# EAGLE design ECE445-Receiver-Schematic (EAGLE 7.5.0)
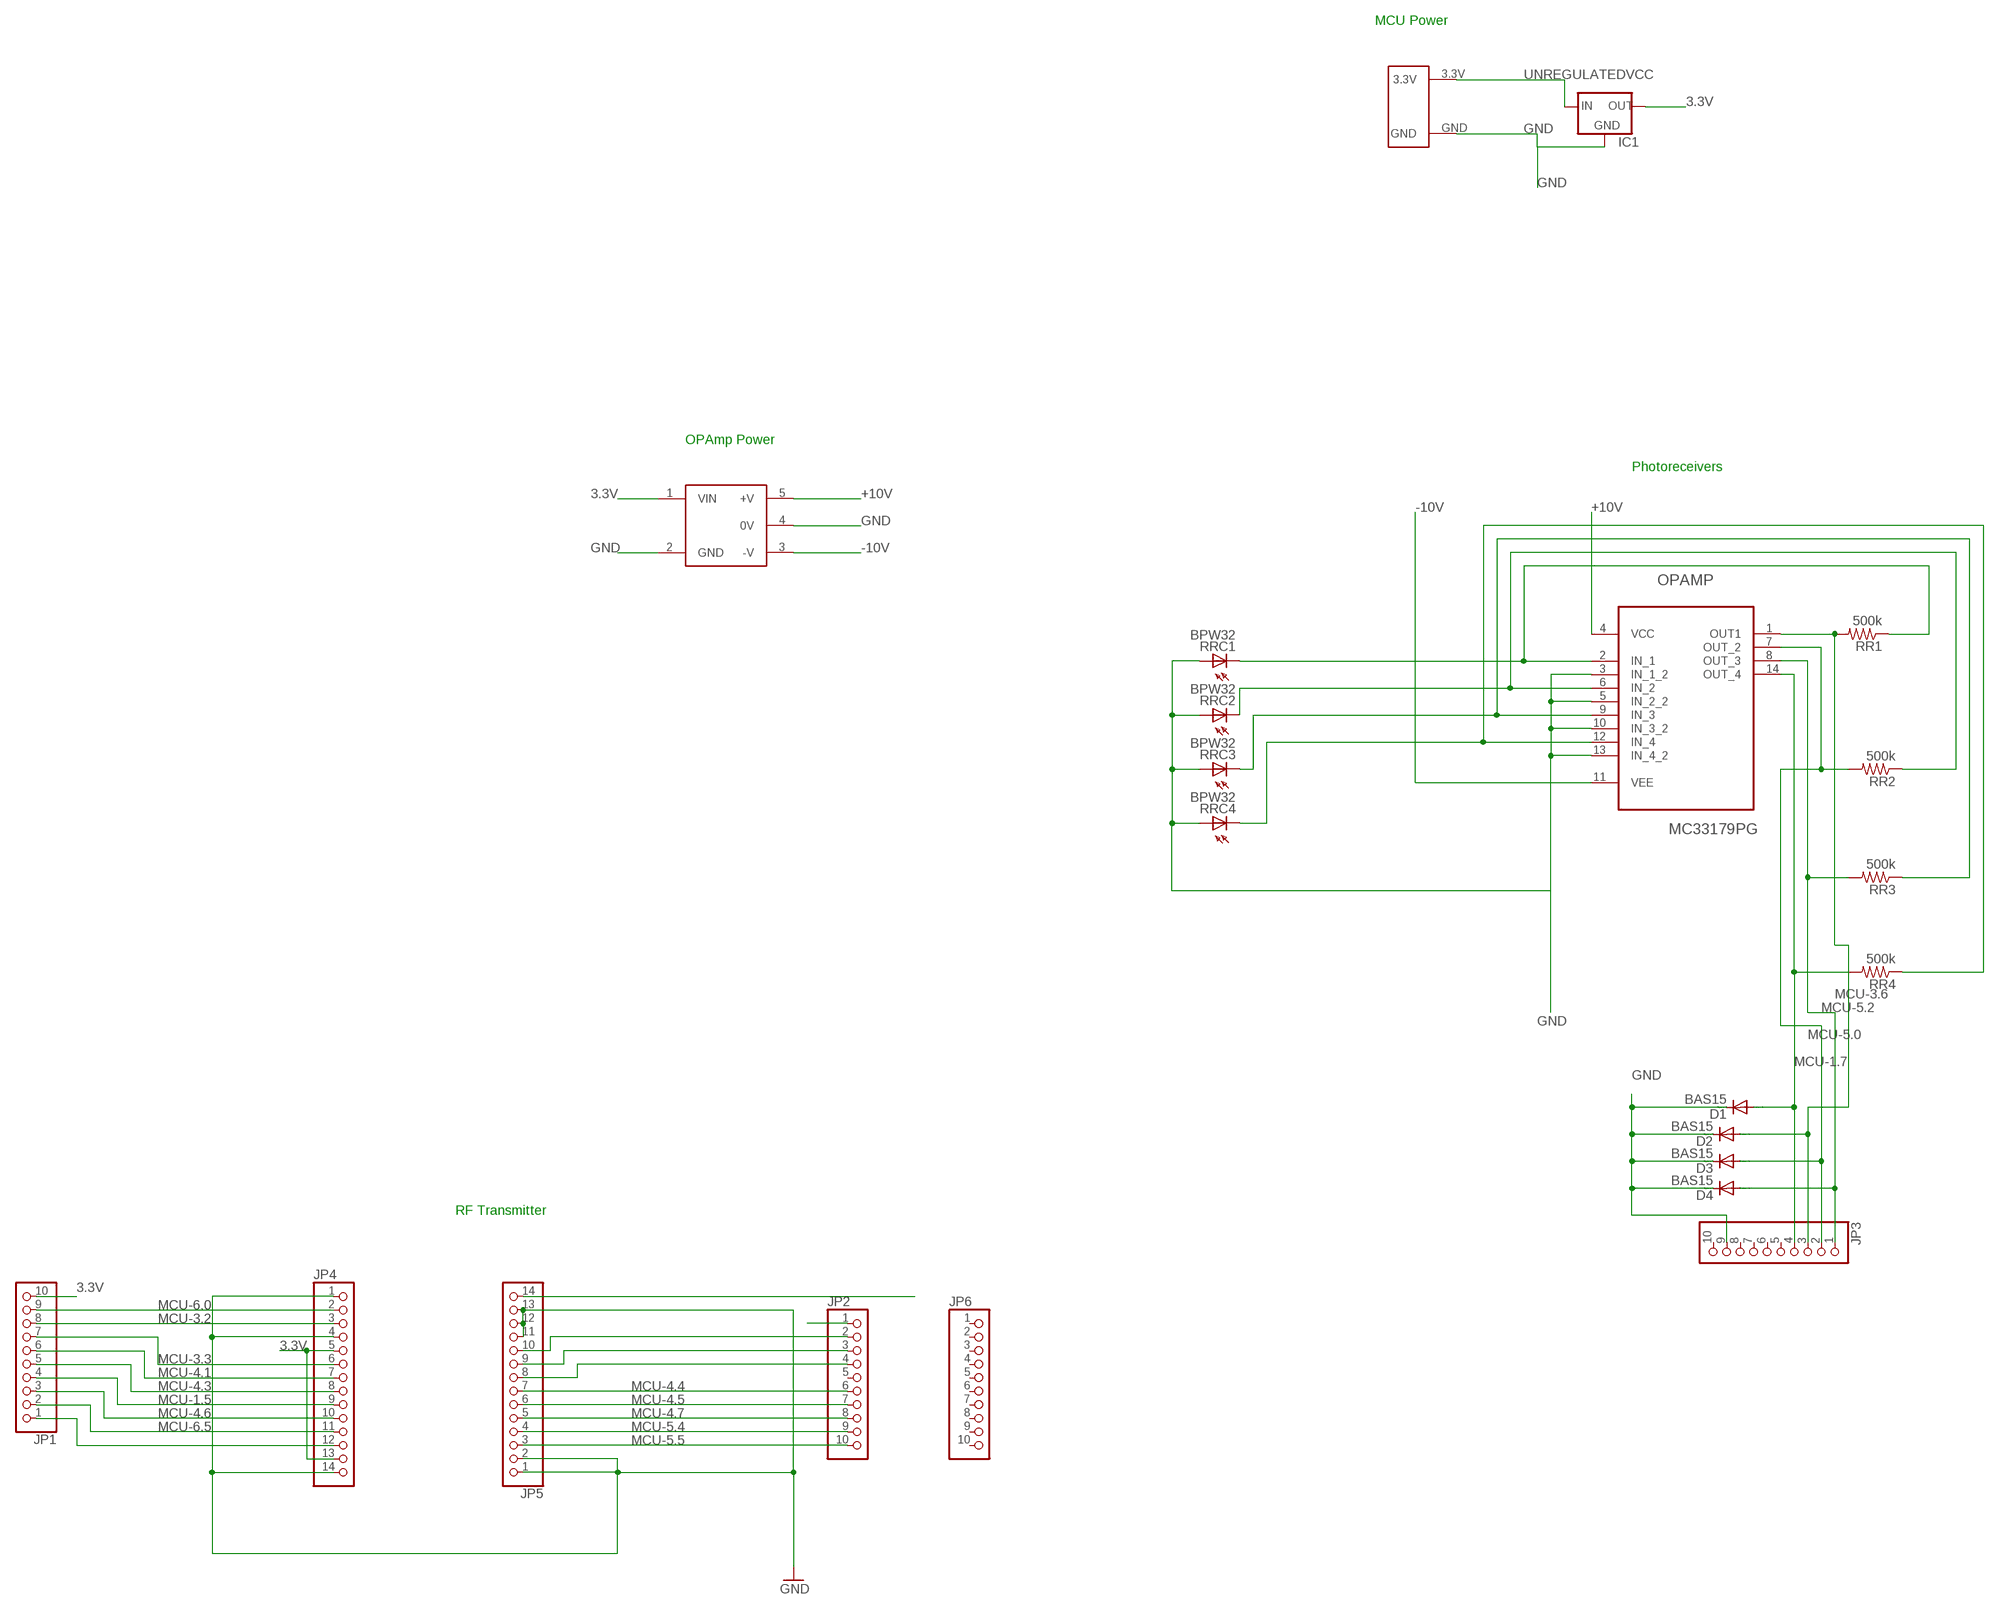
[diagram p0: schematic, sheet 1]

## Parts
D1  BAS15  [DO34-7]
D2  BAS15  [DO34-7]
D3  BAS15  [DO34-7]
D4  BAS15  [DO34-7]
IC1  78LXX  [78LXX]
JP1  PINHD-1X10  [1X10]
JP2  PINHD-1X10  [1X10]
JP3  PINHD-1X10  [1X10]
JP4  PINHD-1X14  [1X14]
JP5  PINHD-1X14  [1X14]
JP6  PINHD-1X10  [1X10]
OPAMP  MC33179PG  [DIP254P762X469-14]
RR1  500k  R-US_0204/5  [0204/5]
RR2  500k  R-US_0204/5  [0204/5]
RR3  500k  R-US_0204/5  [0204/5]
RR4  500k  R-US_0204/5  [0204/5]
RRC1  BPW32  [BPW32]
RRC2  BPW32  [BPW32]
RRC3  BPW32  [BPW32]
RRC4  BPW32  [BPW32]
U$13  PDM1-S3-D12-S  [PDM1-S3-D12-S]
U$14  BATTERY  [BATTERY]

## Nets
3.3V: IC1.OUT JP1.10 JP4.5 JP4.13 U$13.1(VIN)
+10V: OPAMP.4(VCC) U$13.5(+V)
-10V: OPAMP.11(VEE) U$13.3(-V)
ANT: JP5.14
GND: D1.C D2.C D3.C D4.C IC1.GND JP2.1 JP3.9 JP4.1 JP4.4 JP4.14 JP5.1 JP5.2 JP5.11 JP5.12 JP5.13 OPAMP.3(IN_1_2) OPAMP.5(IN_2_2) OPAMP.10(IN_3_2) OPAMP.13(IN_4_2) RRC1.A RRC2.A RRC3.A RRC4.A U$13.2(GND) U$13.4(0V) U$14.GND
MCU-1.5: JP1.4 JP4.9
MCU-1.7: D4.A JP3.1 OPAMP.8(OUT_3) RR3.2
MCU-3.2: JP1.8 JP4.3
MCU-3.3: JP1.7 JP4.6
MCU-3.6: D1.A JP3.4 OPAMP.14(OUT_4) RR4.2
MCU-4.1: JP1.6 JP4.7
MCU-4.3: JP1.5 JP4.8
MCU-4.4: JP2.6 JP5.7
MCU-4.5: JP2.7 JP5.6
MCU-4.6: JP1.3 JP4.10
MCU-4.7: JP2.8 JP5.5
MCU-5.0: D3.A JP3.2 OPAMP.7(OUT_2) RR2.2
MCU-5.2: D2.A JP3.3 OPAMP.1(OUT1) RR1.2
MCU-5.4: JP2.9 JP5.4
MCU-5.5: JP2.10 JP5.3
MCU-6.0: JP1.9 JP4.2
MCU-6.4: JP1.1 JP4.12
MCU-6.5: JP1.2 JP4.11
N$1: JP2.2 JP5.10
N$4: JP2.3 JP5.9
N$5: JP2.4 JP5.8
N$10: OPAMP.6(IN_2) RR2.1 RRC2.K(C)
N$14: OPAMP.9(IN_3) RR3.1 RRC3.K(C)
RRC1: OPAMP.2(IN_1) RR1.1 RRC1.K(C)
RRC4: OPAMP.12(IN_4) RR4.1 RRC4.K(C)
UNREGULATEDVCC: IC1.IN U$14.3.3V
Unconnected: JP2.5 JP3.5 JP3.6 JP3.7 JP3.8 JP3.10 JP6.1 JP6.2 JP6.3 JP6.4 JP6.5 JP6.6 JP6.7 JP6.8 JP6.9 JP6.10

## Notes on the sheet
- MCU Power
- OPAmp Power
- Photoreceivers
- RF Transmitter

## Library data of the parts
D1-D4 = diode:BAS15: DIODE high speed
IC1 = MarkSmartsPartsSpring2015:78LXX: VOLTAGE REGULATOR
JP1-JP3 JP6 = pinhead:PINHD-1X10: PIN HEADER
JP4 JP5 = pinhead:PINHD-1X14: PIN HEADER
OPAMP = ON Semiconductor_By_element14_Batch_1:MC33179PG: Operational Amplifiers; MPN: MC33179PG; OC_FARNELL: 9666826; OC_NEWARK: 26K4013; PACKAGE: PDIP-14; SUPPLIER: On Semiconductor
RR1-RR4 = rcl:R-US_: RESISTOR, American symbol
RRC1-RRC4 = opto-trans-siemens:BPW32: PHOTO DIODE; OC_FARNELL: unknown; OC_NEWARK: unknown
U$13 = PDM1-S3-D12-S:PDM1-S3-D12-S
U$14 = battery:BATTERY

## Module PHOTORECEIVER
Ports: IN(io) OUT(io)

### Library data of the parts

## Board
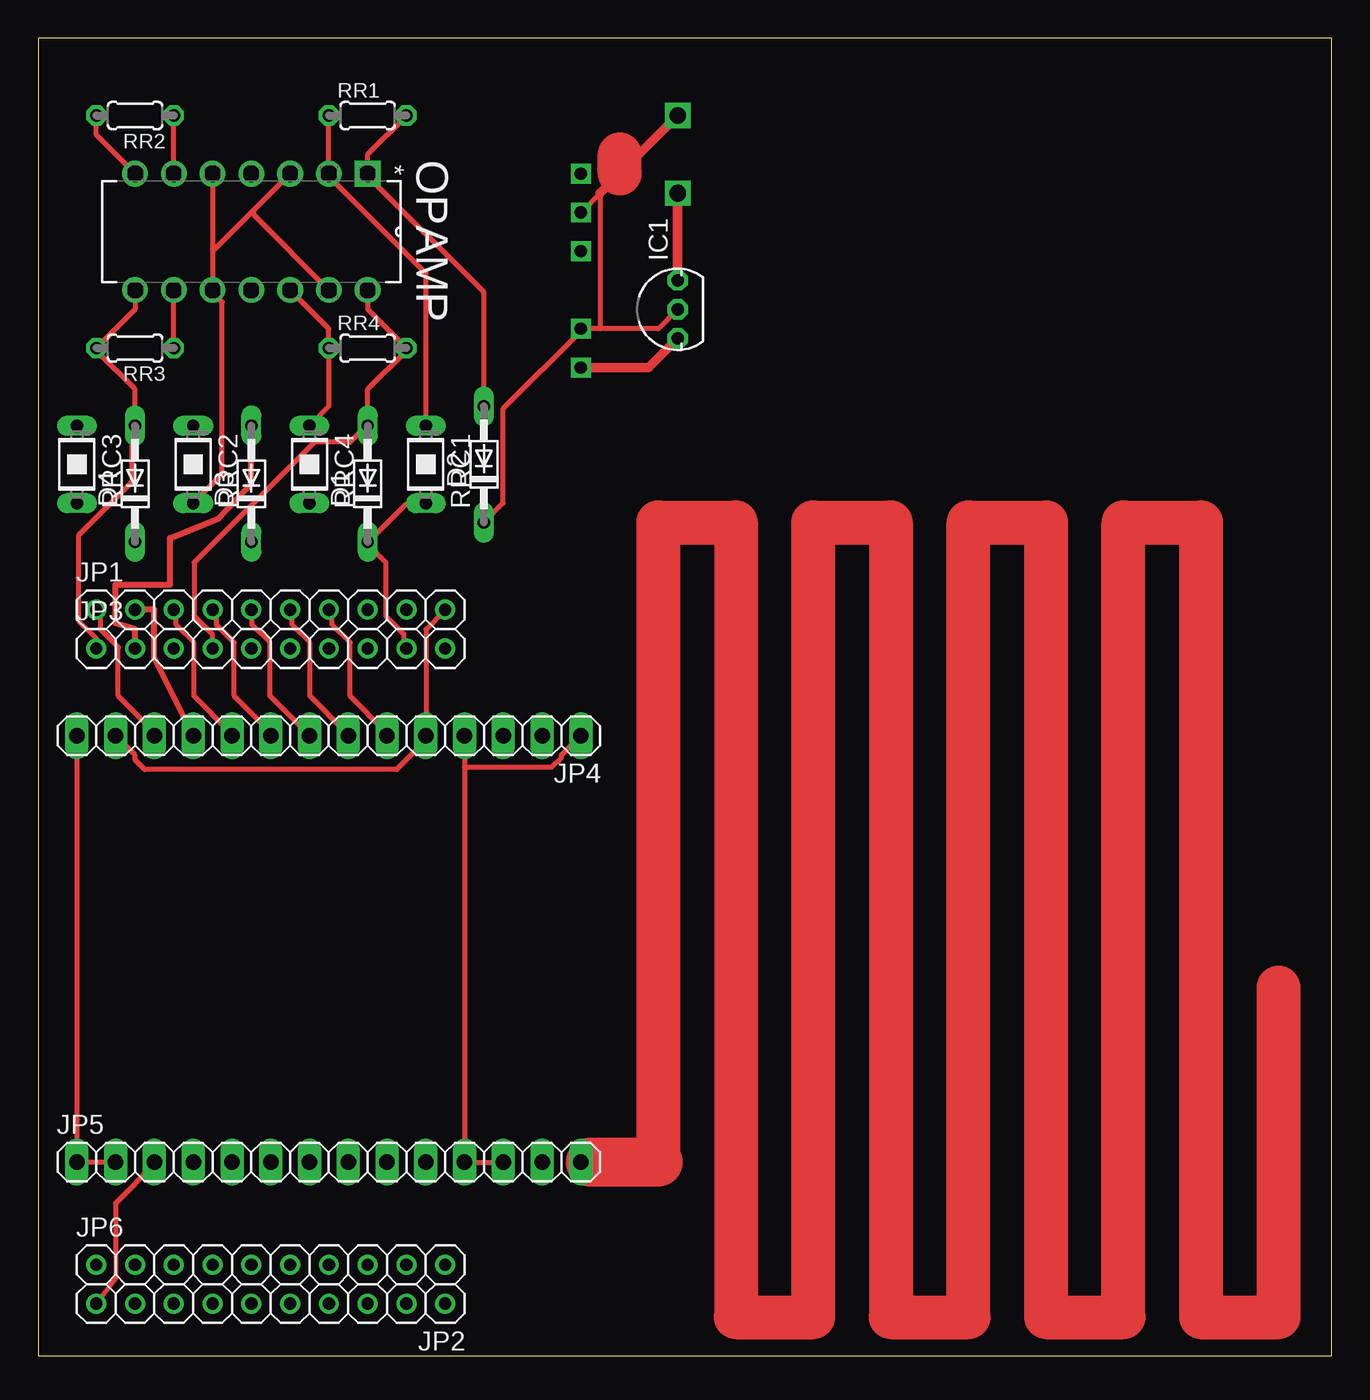
[diagram p1: board, top side]
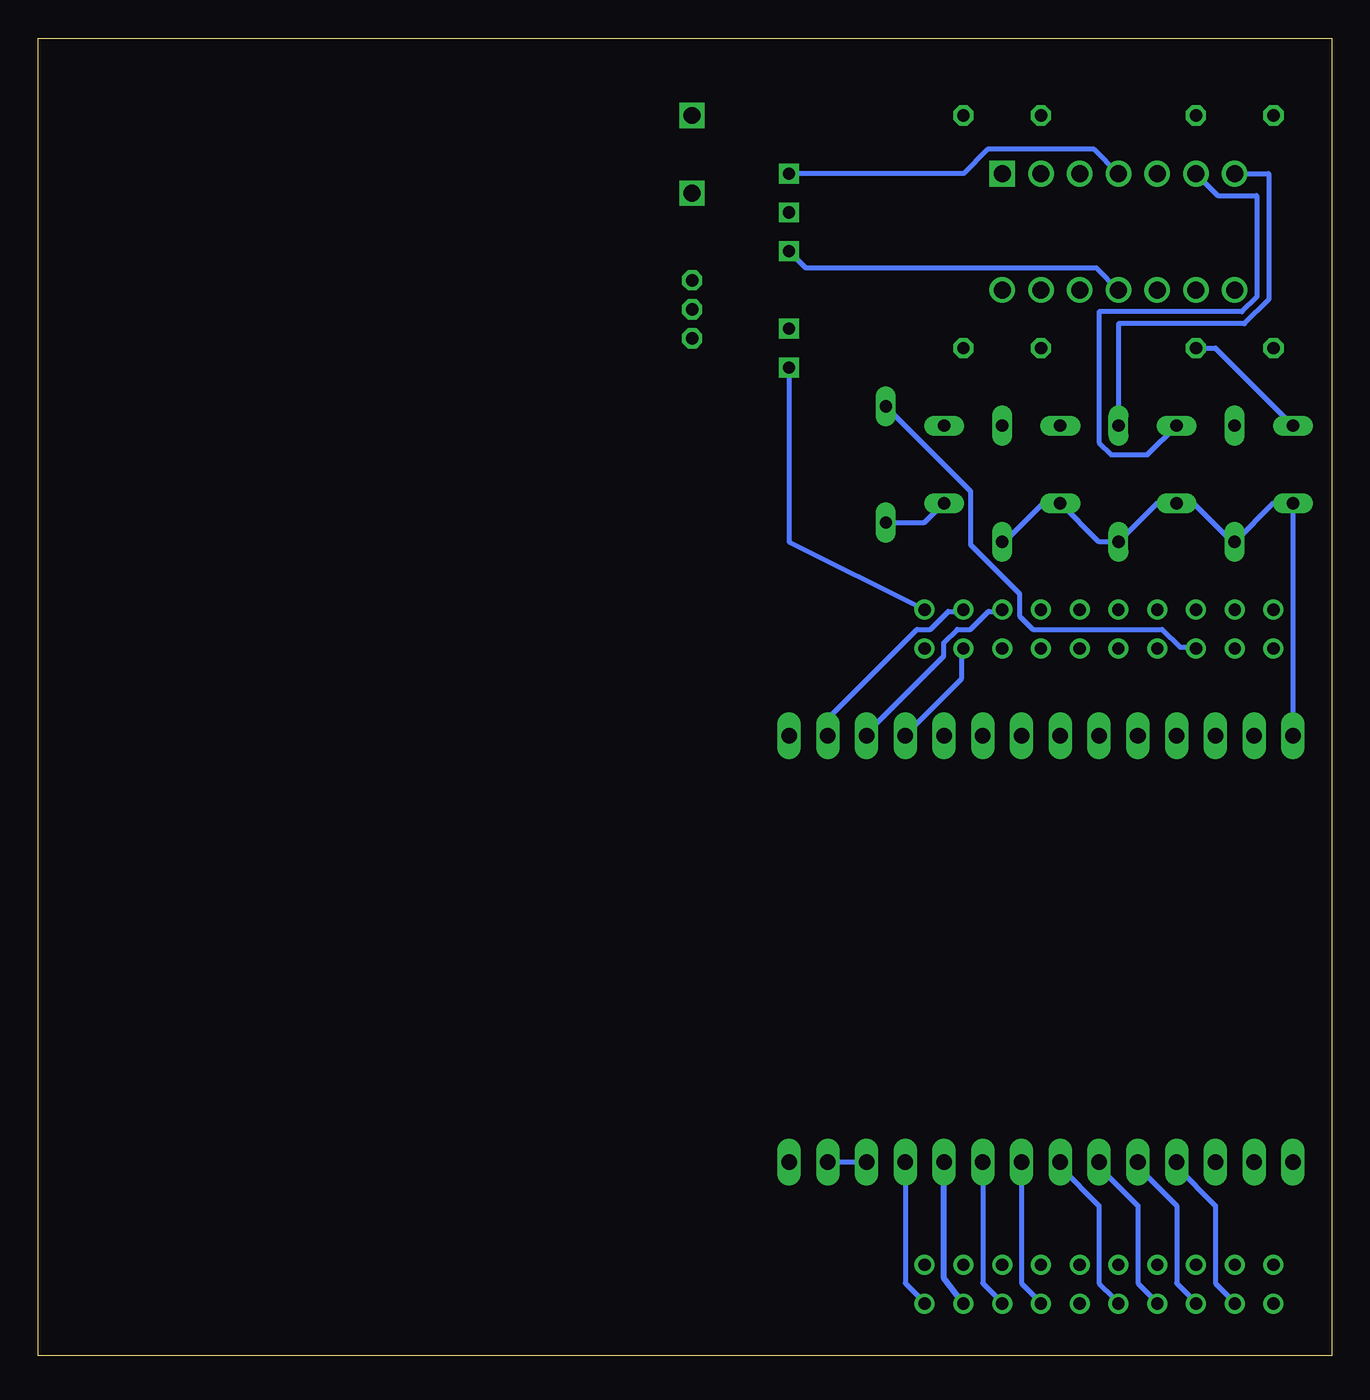
[diagram p2: board, bottom side, seen from below]

Size 84.76 x 86.35 mm. Coordinates in mm from the lower left corner, seen from the top.
Outline: 0,0 84.76,0 84.76,86.35 0,86.35 0,0
Copper layers (1*16): Top 0.035mm / dielectric 1.5mm / Bottom 0.035mm
Design rules "MWSEagleDesignRules2 *": minimum track width 13mil, minimum drill 22mil, track to track 10mil, track to pad 10mil, pad to pad 10mil, via to via 10mil, smd to smd 8mil, copper to edge 40mil, drill to drill 8mil, minimum pad ring 10mil, minimum via ring 8mil, stop-mask expansion 4mil, vias tented up to drill 0mil, thermal gap 10mil
vRestrict: area 3.8,69.8 to 24.1,77.5

### Footprints (pad centres in the part's own frame; a part is rotated, then mirrored left to right if it is on the bottom)
DO34-7 = drill 0.813 long: A 3.81,0; C -3.81,0
78LXX = drill 0.813 octagon: GND 0,0; IN 1.905,0; OUT -1.905,0
1X10 = drill 0.8: 1 -11.43,0; 2 -8.89,0; 3 -6.35,0; 4 -3.81,0; 5 -1.27,0; 6 1.27,0; 7 3.81,0; 8 6.35,0; 9 8.89,0; 10 11.43,0; 11 -8.89,0
1X14 = drill 1.016 long: 1 -16.51,0; 2 -13.97,0; 3 -11.43,0; 4 -8.89,0; 5 -6.35,0; 6 -3.81,0; 7 -1.27,0; 8 1.27,0; 9 3.81,0; 10 6.35,0; 11 8.89,0; 12 11.43,0; 13 13.97,0; 14 16.51,0
DIP254P762X469-14 = drill 1.118 square: 1 -7.62,15.24 | drill 1.118: 2 -7.62,12.7; 3 -7.62,10.16; 4 -7.62,7.62; 5 -7.62,5.08; 6 -7.62,2.54; 7 -7.62,0; 8 0,0; 9 0,2.54; 10 0,5.08; 11 0,7.62; 12 0,10.16; 13 0,12.7; 14 0,15.24
0204/5 = drill 0.813 octagon: 1 -2.54,0; 2 2.54,0
BPW32 = drill 0.813 long: A 0,2.54; K 0,-2.54
PDM1-S3-D12-S = drill 0.8 square: 1 -5.08,0; 2 -2.54,0; 3 2.54,0; 4 5.08,0; 5 7.62,0
BATTERY = drill 1.1 square: 3.3V -2.54,0; GND 2.54,0

### Placement (x,y rotation side)
D1  21.59,57.15 90 top
D2  29.21,58.42 90 top
D3  13.97,57.15 90 top
D4  6.35,57.15 90 top
IC1  41.91,68.58 90 top
JP1  15.24,48.9 0 top
JP2  15.24,3.43 180 top
JP3  15.24,46.35 0 top
JP4  19.05,40.64 180 top
JP5  19.05,12.7 0 top
JP6  15.24,5.97 0 top
OPAMP  6.35,69.85 270 top
RR1  21.59,81.28 0 top
RR2  6.35,81.28 180 top
RR3  6.35,66.04 180 top
RR4  21.59,66.04 0 top
RRC1  25.4,58.42 180 top
RRC2  10.16,58.42 180 top
RRC3  2.54,58.42 180 top
RRC4  17.78,58.42 180 top
U$13  35.56,69.85 90 top
U$14  41.91,78.74 90 top

### Tracks (layer width: path | path; a pad name or v marks a point on that pad's centre or on a via)
3.3V
  Top 0.33: JP4.13 6.35,39.37 6.35,39.05 6.99,38.42 23.5,38.42 25.4,40.32 JP4.5 25.41,40.89 25.41,47.61 26.58,48.78 JP1.10
  Top 0.61: U$13.1 40.01,64.77 IC1.OUT
  Bottom 0.33: JP1.10 35.56,53.34 U$13.1
+10V
  Bottom 0.33: U$13.5 24.13,77.47 22.54,79.06 15.56,79.06 OPAMP.4
-10V
  Bottom 0.33: U$13.3 34.45,71.28 15.4,71.28 OPAMP.11
GND
  Top 0.33: JP5.12 JP5.11 27.94,38.58 | JP4.4 27.94,38.58 | 36.83,67.31 40.64,67.31 IC1.GND | 36.83,67.31 U$13.2 35.56,67.15 30.48,62.07 30.48,55.88 D2.C | U$13.4 36.83,76.2 36.83,67.31 | JP5.2 JP5.1 JP4.14 | JP4.1 34.29,39.37 34.29,39.21 33.66,38.58 27.94,38.58 | OPAMP.5 11.43,72.55 | 11.43,72.55 OPAMP.10 11.43,69.69 12.06,69.06 12.06,57.78 RRC2.A | 14.05,75.01 11.59,72.55 11.43,72.55 | 14.05,75.01 OPAMP.3 | OPAMP.13 14.13,74.77 14.13,74.93 14.05,75.01 | RRC1.A 25.09,55.8 24.11,55.8 21.79,53.49 D1.C 21.61,53.16 22.78,51.99 22.78,48.49 23.95,47.32 23.95,46.44 JP3.9
  Top 0.61: U$14.GND 38.1,77.47 36.83,76.2
  Top 2.896: 38.1,77.47 38.1,78.74
  Bottom 0.33: JP2.1 26.99,3.81 27.94,4.76 JP5.11 | JP5.12 JP5.13 | RRC1.A 26.67,54.61 D2.C | JP4.14 RRC3.A 3.81,55.88 D4.C 6.51,53.34 9.05,55.88 RRC2.A 11.43,55.88 D3.C 15.24,53.34 RRC4.A 18.89,55.88 21.43,53.34 D1.C | JP3.9 24.24,46.15 24.24,44.4 27.75,40.89 JP4.4
MCU-1.5
  Top 0.33: JP1.4 11.68,48.78 11.68,47.9 12.85,46.74 12.85,43.23 15.19,40.89 JP4.9
MCU-1.7
  Top 0.33: OPAMP.8 6.35,68.58 RR3.2 3.81,65.88 6.35,63.34 D4.A 6.13,60.76 6.13,57.25 2.63,53.75 2.63,48.2 3.8,47.03 3.8,46.44 JP3.1
MCU-3.2
  Bottom 0.33: JP1.8 21.61,48.78 22.49,48.78 23.66,47.61 24.54,47.61 25.41,46.74 25.41,45.86 30.38,40.89 JP4.3
MCU-3.3
  Top 0.33: JP1.7 19.28,48.78 19.28,47.9 20.45,46.74 20.45,43.23 22.78,40.89 JP4.6
MCU-3.6
  Top 0.33: OPAMP.14 21.59,68.58 RR4.2 24.13,65.88 21.59,63.34 D1.A 21.32,60.76 20.45,59.88 18.11,59.88 10.22,51.99 10.22,48.49 11.39,47.32 11.39,46.44 JP3.4
MCU-4.1
  Top 0.33: JP1.6 16.65,48.78 16.65,47.9 17.82,46.74 17.82,43.23 20.16,40.89 JP4.7
MCU-4.3
  Top 0.33: JP4.8 15.19,43.23 15.19,46.74 14.02,47.9 14.02,48.78 JP1.5
MCU-4.4
  Bottom 0.33: JP2.6 14.29,3.81 15.24,4.76 15.24,9.84 17.78,12.38 JP5.7
MCU-4.5
  Bottom 0.33: JP2.7 11.75,3.81 12.7,4.76 12.7,9.84 15.24,12.38 JP5.6
MCU-4.6
  Top 0.33: JP1.3 9.05,48.78 9.05,47.9 10.22,46.74 10.22,43.23 12.56,40.89 JP4.10
MCU-4.7
  Bottom 0.33: JP2.8 9.21,3.81 10.16,4.76 10.16,9.84 12.7,12.38 JP5.5
MCU-5.0
  Top 0.33: RR2.2 3.81,80.01 OPAMP.7
  Top 0.406: JP3.2 6.35,47.62 5.08,48.01 5.08,50.55 8.64,50.55 8.64,53.59 11.81,54.86 13.97,57.15 D3.A
  Bottom 0.33: D3.A 13.97,67.63 5.71,67.63 4.13,69.22 4.13,77.47 OPAMP.7
MCU-5.2
  Top 0.33: RR1.2 21.59,78.74 OPAMP.1 21.59,77.31 29.21,69.69 D2.A
  Bottom 0.33: JP3.3 9.05,46.44 9.93,46.44 11.1,47.61 19.57,47.61 20.45,48.49 20.45,49.95 23.66,53.16 23.66,56.67 29.21,62.22 D2.A
MCU-5.4
  Bottom 0.33: JP2.9 6.67,3.81 7.62,4.76 7.62,9.84 10.16,12.38 JP5.4
MCU-5.5
  Top 0.33: JP2.10 5.08,5.08 5.08,10 7.62,12.54 JP5.3
MCU-6.0
  Bottom 0.33: JP1.9 24.24,48.78 25.12,48.78 26.29,47.61 27.16,47.61 33.01,41.77 33.01,40.89 JP4.2
MCU-6.4
  Top 0.33: JP1.1 4.09,48.78 4.09,47.61 5.26,46.44 5.26,43.23 7.59,40.89 JP4.12
MCU-6.5
  Top 0.406: JP4.11 7.62,45.72 7.62,48.9 JP1.2
N$1
  Bottom 0.406: JP2.2 25.4,5.08 JP5.10
N$4
  Bottom 0.33: JP2.3 21.91,3.81 22.86,4.76 JP5.9
N$5
  Bottom 0.33: JP2.4 19.37,3.81 20.32,4.76 JP5.8
N$7
  Top 2.896: 40.64,12.7 40.64,54.61 45.72,54.61 45.72,2.54 50.8,2.54 50.8,54.61 55.88,54.61 55.88,2.54 60.96,2.54 60.96,54.61 66.04,54.61 66.04,2.54 71.12,2.54 71.12,54.61 76.2,54.61 76.2,2.54 81.28,2.54 81.28,24.13
  Top 3.226: 40.64,12.7 36.2,12.7
N$10
  Top 0.33: OPAMP.6 RR2.1
  Bottom 0.33: RRC2.K 12.06,59.05 14.45,59.05 15.24,59.85 15.24,68.42 5.87,68.42 4.92,69.37 4.92,76.04 7.46,76.04 OPAMP.6
N$14
  Top 0.33: RR3.1 OPAMP.9
  Bottom 0.33: RRC3.K 7.62,66.04 RR3.1
RRC1
  Top 0.33: RR1.1 OPAMP.2 19.05,77.31 25.4,70.96 RRC1.K
RRC4
  Top 0.33: RRC4.K 19.05,62.23 RR4.1 19.05,67.31 OPAMP.12
UNREGULATEDVCC
  Top 0.61: U$14.3.3V IC1.IN